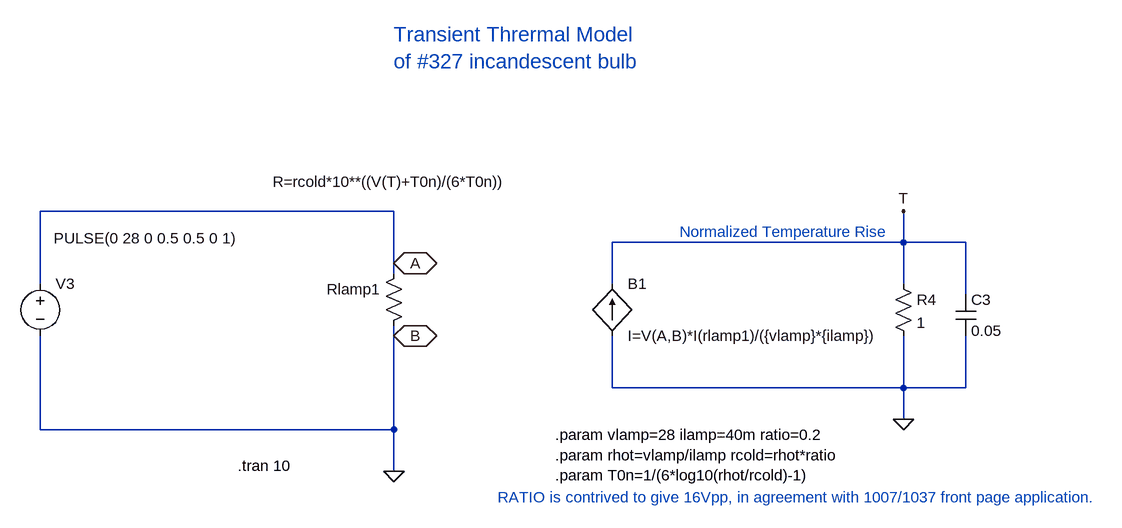
[diagram p0: schematic bulb_curve_tracer_ideal.asc]
bulb_curve_tracer_ideal.asc, the LTspice schematic file:
Version 4
SHEET 1 1952 720
WIRE 32 112 -512 112
WIRE 816 160 816 112
WIRE 816 160 368 160
WIRE 912 160 816 160
WIRE 32 192 32 112
WIRE 32 208 32 192
WIRE -512 224 -512 112
WIRE 368 224 368 160
WIRE 816 224 816 160
WIRE 912 240 912 160
WIRE 32 304 32 288
WIRE 368 384 368 304
WIRE 816 384 816 304
WIRE 816 384 368 384
WIRE 912 384 912 304
WIRE 912 384 816 384
WIRE 816 432 816 384
WIRE -512 448 -512 304
WIRE 32 448 32 304
WIRE 32 448 -512 448
WIRE 32 512 32 448
FLAG 32 512 0
FLAG 816 112 T
FLAG 32 192 A
IOPIN 32 192 BiDir
FLAG 32 304 B
IOPIN 32 304 BiDir
FLAG 816 432 0
SYMBOL bi2 368 224 R0
SYMATTR InstName B1
SYMATTR Value I=V(A,B)*I(rlamp1)/({vlamp}*{ilamp})
SYMBOL res 800 208 R0
SYMATTR InstName R4
SYMATTR Value 1
SYMBOL cap 896 240 R0
SYMATTR InstName C3
SYMATTR Value 0.05
SYMBOL res 48 192 M0
WINDOW 3 -160 -125 Left 2
SYMATTR Value R=rcold*10**((V(T)+T0n)/(6*T0n))
SYMATTR InstName Rlamp1
SYMBOL voltage -512 208 R0
WINDOW 3 21 -54 Left 2
WINDOW 123 0 0 Left 0
WINDOW 39 0 0 Left 0
SYMATTR Value PULSE(0 28 0 0.5 0.5 0 1)
SYMATTR InstName V3
TEXT -208 504 Left 2 !.tran 10
TEXT 280 456 Left 2 !.param vlamp=28 ilamp=40m ratio=0.2\n.param rhot=vlamp/ilamp rcold=rhot*ratio\n.param T0n=1/(6*log10(rhot/rcold)-1)
TEXT 192 552 Left 2 ;RATIO is contrived to give 16Vpp, in agreement with 1007/1037 front page application.
TEXT 472 144 Left 2 ;Normalized Temperature Rise
TEXT 32 -160 Left 3 ;Transient Thrermal Model\nof #327 incandescent bulb

The netlist it stands for:
* bulb_curve_tracer_ideal.asc
B1 0 T I=V(A,B)*I(rlamp1)/({vlamp}*{ilamp})
R4 T 0 1
C3 T 0 0.05
Rlamp1 A 0 R=rcold*10**((V(T)+T0n)/(6*T0n))
V3 A 0 PULSE(0 28 0 0.5 0.5 0 1)
.tran 10
.param vlamp=28 ilamp=40m ratio=0.2
.param rhot=vlamp/ilamp rcold=rhot*ratio
.param T0n=1/(6*log10(rhot/rcold)-1)
* RATIO is contrived to give 16Vpp, in agreement with 1007/1037 front page application.
* Normalized Temperature Rise
* Transient Thrermal Model
* of #327 incandescent bulb
.backanno
.end